# Altium schematic sheet 07_WI-FI.SchDoc: =GlobalProjectName
size 594 x 420 mm; ApprovedBy: Галкин; CheckedBy: Галкин; Author: Данич; SheetNumber: 7; SheetTotal: 8; PageSetup: Record=PageOptions|CenterHorizontal=True|CenterVertical=True|PrintScale=0.70|XCorrection=1.00|YCorrection=1.00|PrintKind=2|BorderSize=5000000|LeftOffset=9000|BottomOffset=10100|Orientation=2|PaperLength=11176|PaperWidth=8636|Scale=100|PaperSource=259|PrintQuality=-3|MediaType=1|DitherType=10|PrintScaleMode=1|PaperKind=A3|PaperIndex=8
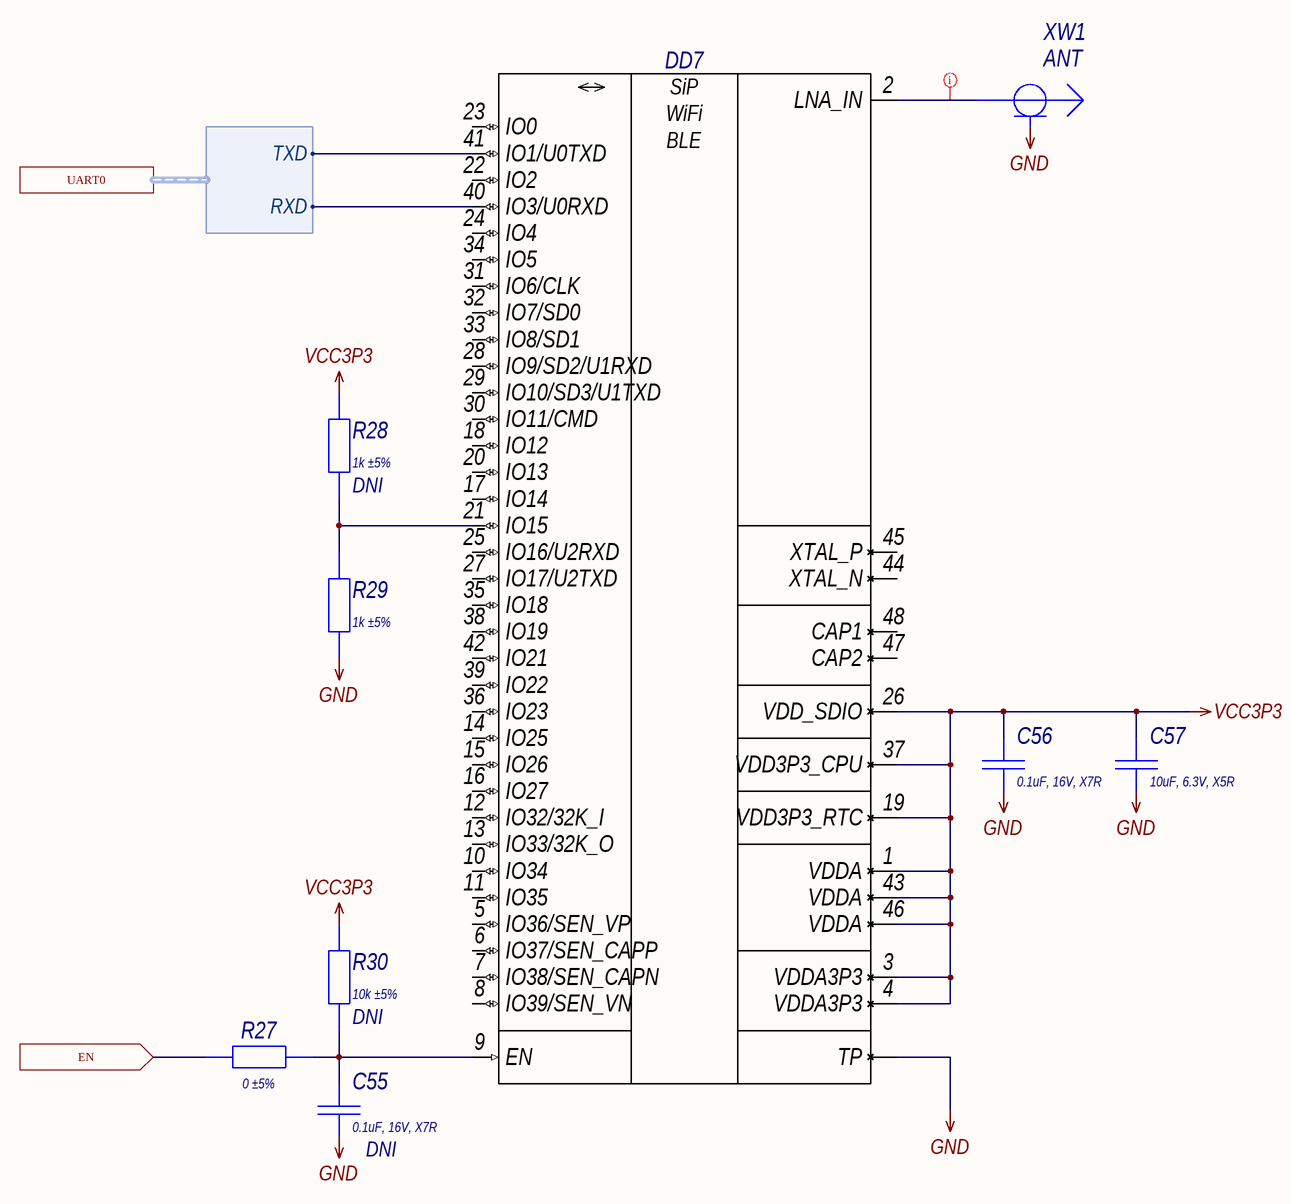
[diagram p0: 07_WI-FI.SchDoc]

## Parts
C55  Schematic Value: 0.1uF, 16V, X7R  [C0402_L]  (hidden comment: Capacitor)  (no BOM)
C56  Schematic Value: 0.1uF, 16V, X7R  [C0402_L]  (hidden comment: Capacitor)
C57  Schematic Value: 10uF, 6.3V, X5R  [C0402_L]  (hidden comment: Capacitor)
DD7  ESP32-PICO-D4  [QFN-48_050P700X700X104_N]  (value not drawn)
R27  Schematic Value: 0 ±5%  [R0402_L]  (hidden comment: Resistor)
R28  Schematic Value: 1k ±5%  [R0402_L]  (hidden comment: Resistor)  (no BOM)
R29  Schematic Value: 1k ±5%  [R0402_L]  (hidden comment: Resistor)
R30  Schematic Value: 10k ±5%  [R0402_L]  (hidden comment: Resistor)  (no BOM)
XW1  ANT  [1909763-1]

## Ports
EN (in), UART0 (harness UART0)

## Harnesses
UART0: RXD, TXD

## Nets
GND: C55.1 C56.1 C57.1 DD7.TP R29.1 XW1.2
VCC3P3: C56.2 C57.2 DD7.1(VDDA) DD7.3(VDDA3P3) DD7.4(VDDA3P3) DD7.19(VDD3P3_RTC) DD7.26(VDD_SDIO) DD7.37(VDD3P3_CPU) DD7.43(VDDA) DD7.46(VDDA) R28.2 R30.2
EN: R27.1 ; port EN
NetC55_2: C55.2 DD7.9(EN) R27.2 R30.1
NetDD7_2: DD7.2(LNA_IN) XW1.1
NetDD7_21: DD7.21(IO15) R28.1 R29.2
NetDD7_40: DD7.40(IO3/U0RXD) ; port UART0.RXD
NetDD7_41: DD7.41(IO1/U0TXD) ; port UART0.TXD

Not connected (* = marked no-connect by the designer): DD7 5(IO36/SEN_VP) 6(IO37/SEN_CAPP) 7(IO38/SEN_CAPN) 8(IO39/SEN_VN) 10(IO34) 11(IO35) 12(IO32/32K_I) 13(IO33/32K_O) 14(IO25) 15(IO26) 16(IO27) 17(IO14) 18(IO12) 20(IO13) 22(IO2) 23(IO0) 24(IO4) 25(IO16/U2RXD) 27(IO17/U2TXD) 28(IO9/SD2/U1RXD) 29(IO10/SD3/U1TXD) 30(IO11/CMD) 31(IO6/CLK) 32(IO7/SD0) 33(IO8/SD1) 34(IO5) 35(IO18) 36(IO23) 38(IO19) 39(IO22) 42(IO21) 44(XTAL_N) 45(XTAL_P) 47(CAP2) 48(CAP1)

## Layout directives
net class RF: NetDD7_2

## Notes on the sheet
- (near R28) DNI
- (near R30) DNI
- (near C55) DNI
- Подп. и дата
- Инв. № дубл.
- Взам. инв. №
- Инв. № подл.
- Изм.
- Лист
- № докум.
- Подп.
- Дата
- Форма 2а ГОСТ 2.104-2006
- Копировал
- Формат А2
- (in symbol ESP32-PICO-D4) SiP; WiFi; BLE

## Library data of the parts
C55 C56 = GCM155R71C104KA55D: Manufacturer: Murata; Type: Конденсатор; ID: 163; Value: 0.1uF; Voltage: 16V; Tolerance: ±10%; Dielectric Type: X7R; Application Category: 1; Working Temperature Min: -55°С; Working Temperature Max: +125°С; Functional Analog: GRM155R71C104KA88D; Published: 18.05.2010; Publisher: Andrew Danich; Part Number: GCM155R71C104KA55D; Footprint: 0402
C57 = GRM155R60J106ME15D: Manufacturer: Murata; Type: Конденсатор; ID: 234; Value: 10uF; Voltage: 6.3V; Tolerance: ±20%; Dielectric Type: X5R; Application Category: 1; Working Temperature Min: -55°С; Working Temperature Max: +85°С; Published: 18.05.2010; Publisher: Andrew Danich; Part Number: GRM155R60J106ME15D; Footprint: 0402
DD7 = ESP32-PICO-D4: Manufacturer: Espressif Systems; ID: 1; Supply Operation: +500mA; Supply Current: +2.7…3.6V; ROM/RAM: 4M/; Wireless Compatibility: Wi-Fi, Bluetooth; Supported Interfaces: GPIO, I2C, I2S, SPI, UART, SDIO, ADC, DAC; I/O Lines: 34; Operation Frequency: 240 MHz; Working Temperature Min: -40°С; Working Temperature Max: +85°С; Published: 20.05.2020; Publisher: Andrew Danich; Type: Модуль; Part Number: ESP32-PICO-D4; Value: ESP32-PICO-D4; Application Category: 1
R27 = RC0402JR-070RL: Manufacturer: Yageo; ID: 362; Value: 0; Limit Voltage: 50V; Tolerance: ±5%; Temperature Coefficient: 100ppm; Total Power Dissipation: 0.1W; Series Type: Thick-Film; Application Category: 1; Working Temperature Min: -55°С; Working Temperature Max: +155°С; Published: 24.03.2010; Publisher: Andrew Danich; Type: Резистор; Part Number: RC0402JR-070RL; Footprint: 0402
R28 R29 = RC0402JR-071KL: Manufacturer: Yageo; ID: 3; Value: 1k; Limit Voltage: 50V; Tolerance: ±5%; Temperature Coefficient: 100ppm; Total Power Dissipation: 0.1W; Series Type: Thick-Film; Application Category: 1; Working Temperature Min: -55°С; Working Temperature Max: +155°С; Published: 24.03.2010; Publisher: Andrew Danich; Type: Резистор; Part Number: RC0402JR-071KL; Footprint: 0402
R30 = RC0402JR-0710KL: Manufacturer: Yageo; ID: 476; Value: 10k; Limit Voltage: 50V; Tolerance: ±5%; Temperature Coefficient: 100ppm; Total Power Dissipation: 0.1W; Series Type: Thick-Film; Application Category: 1; Working Temperature Min: -55°С; Working Temperature Max: +155°С; Published: 24.03.2010; Publisher: Andrew Danich; Type: Резистор; Part Number: RC0402JR-0710KL; Footprint: 0402
XW1 = 1909763-1: Manufacturer: TE Connectivity; ID: 3; Connector Type: Male; Wave Resistance: 50ohm; Surface Finish: Gold; Frequency Band: 6GHz; Application Category: 1; Working Temperature Min: -40°С; Working Temperature Max: +90°С; Published: 19.09.2015; Publisher: НТЦ "Вектор"; Type: Вилка; Part Number: 1909763-1; Value: 1909763-1; Pins: 3; ClassName: DirectConnect